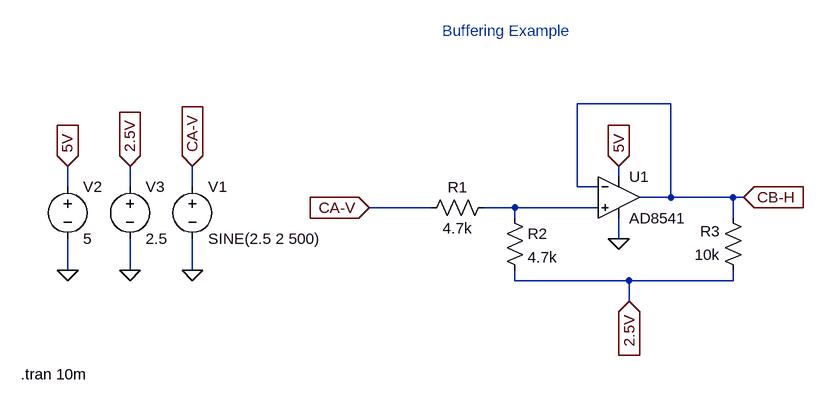
[diagram p0: schematic buffer_example.asc]
buffer_example.asc, the LTspice schematic file:
Version 4
SHEET 1 880 680
WIRE 304 16 160 16
WIRE 224 128 224 112
WIRE -624 144 -624 112
WIRE -528 144 -528 112
WIRE -432 144 -432 112
WIRE 160 144 160 16
WIRE 192 144 160 144
WIRE 304 160 304 16
WIRE 304 160 256 160
WIRE 400 160 304 160
WIRE 416 160 400 160
WIRE -64 176 -160 176
WIRE 64 176 16 176
WIRE 192 176 64 176
WIRE 64 192 64 176
WIRE 400 192 400 160
WIRE 224 224 224 192
WIRE -624 272 -624 224
WIRE -528 272 -528 224
WIRE -432 272 -432 224
WIRE 64 288 64 272
WIRE 240 288 64 288
WIRE 400 288 400 272
WIRE 400 288 240 288
WIRE 240 320 240 288
FLAG -432 272 0
FLAG -624 272 0
FLAG -432 112 CA-V
IOPIN -432 112 In
FLAG -160 176 CA-V
IOPIN -160 176 In
FLAG -624 112 5V
IOPIN -624 112 In
FLAG 240 320 2.5V
IOPIN 240 320 In
FLAG 224 224 0
FLAG -528 272 0
FLAG -528 112 2.5V
IOPIN -528 112 In
FLAG 224 112 5V
IOPIN 224 112 In
FLAG 416 160 CB-H
IOPIN 416 160 In
SYMBOL Opamps\\AD8541 224 96 R0
SYMATTR InstName U1
SYMBOL res 416 288 R180
WINDOW 0 36 76 Left 2
WINDOW 3 36 40 Left 2
SYMATTR InstName R3
SYMATTR Value 10k
SYMBOL res 48 176 R0
SYMATTR InstName R2
SYMATTR Value 4.7k
SYMBOL res 32 160 R90
WINDOW 0 0 56 VBottom 2
WINDOW 3 32 56 VTop 2
SYMATTR InstName R1
SYMATTR Value 4.7k
SYMBOL voltage -432 128 R0
WINDOW 123 0 0 Left 0
WINDOW 39 0 0 Left 0
SYMATTR InstName V1
SYMATTR Value SINE(2.5 2 500)
SYMBOL voltage -624 128 R0
WINDOW 123 0 0 Left 0
WINDOW 39 0 0 Left 0
SYMATTR InstName V2
SYMATTR Value 5
SYMBOL voltage -528 128 R0
WINDOW 123 0 0 Left 0
WINDOW 39 0 0 Left 0
SYMATTR InstName V3
SYMATTR Value 2.5
TEXT -696 432 Left 2 !.tran 10m
TEXT -48 -96 Left 2 ;Buffering Example

The netlist it stands for:
* buffer_example.asc
XU1 N001 CB-H 5V 0 CB-H AD8541  ; pins In+ In- V+ V- OUT
R3 2.5V CB-H 10k
R2 N001 2.5V 4.7k
R1 N001 CA-V 4.7k
V1 CA-V 0 SINE(2.5 2 500)
V2 5V 0 5
V3 2.5V 0 2.5
.tran 10m
* Buffering Example
.backanno
.end